# EAGLE design Gaussmeter_ver2 (EAGLE 6.2)
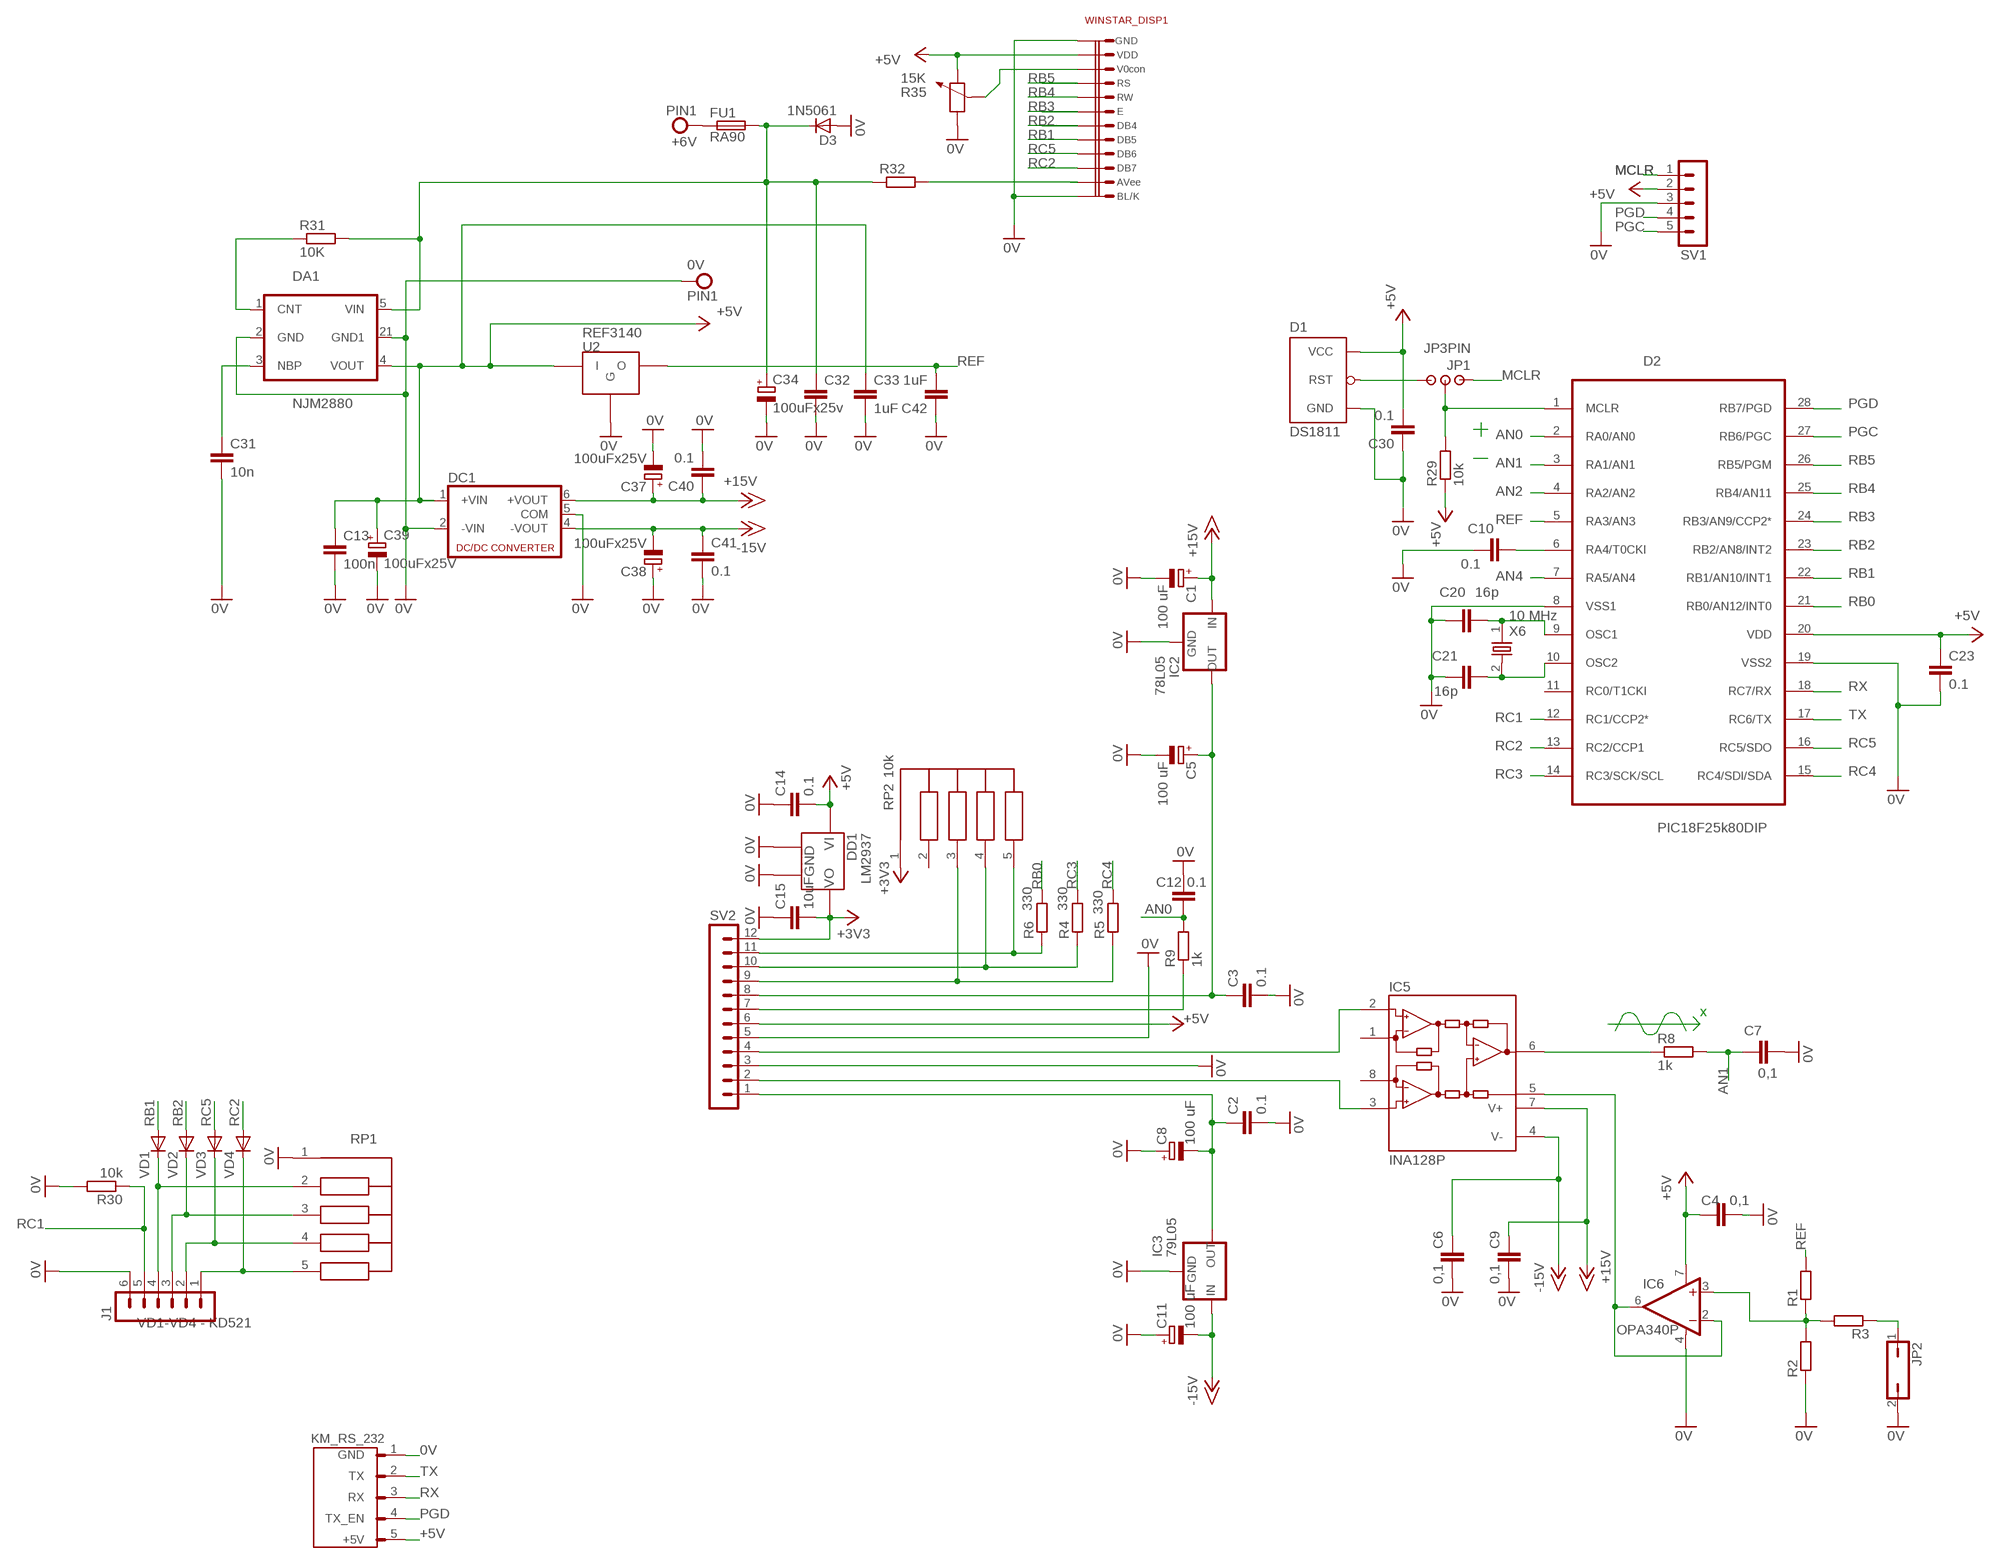
[diagram p0: schematic, sheet 1]

## Parts
0V  PIN1  [PIN1]
+6V  PIN1  [PIN1]
C1  100 uF  CPOL-EUE2.5-6  [E2,5-6]
C2  0.1  C-EUC0805  [C0805]
C3  0.1  C-EUC0805  [C0805]
C4  0,1  C-EUC0805  [C0805]
C5  100 uF  CPOL-EUE2.5-6  [E2,5-6]
C6  0,1  C-EUC0805  [C0805]
C7  0,1  C-EUC0805  [C0805]
C8  100 uF  CPOL-EUE2.5-6  [E2,5-6]
C9  0,1  C-EUC0805  [C0805]
C10  0.1  C0805  [C0805D]
C11  100 uF  CPOL-EUE2.5-6  [E2,5-6]
C12  0.1  C-EUC0805  [C0805]
C13  100n  C0805  [C0805D]
C14  0.1  C0805  [C0805D]
C15  10uF  C0805  [C0805D]
C20  16p  C0805  [C0805D]
C21  16p  C0805  [C0805D]
C23  0.1  C-EUC0805  [C0805]
C30  0.1  C0805  [C0805D]
C31  10n  C0805  [C0805D]
C32  C0805  [C0805D]
C33  1uF  C0805  [C0805D]
C34  100uFx25v  CPOL-EUE2.5-6  [E2,5-6]
C37  100uFx25V  CPOL-EUE2.5-6  [E2,5-6]
C38  100uFx25V  CPOL-EUE2.5-6  [E2,5-6]
C39  100uFx25V  CPOL-EUE2.5-6  [E2,5-6]
C40  0.1  C0805  [C0805D]
C41  0.1  C0805  [C0805D]
C42  1uF  C0805  [C0805D]
D1  DS1811  [TO92-60]
D2  PIC18F25k80DIP  PIC18F2320DIP  [DIL28-3]
D3  1N5061  [DO41-10]
DA1  NJM2880  [SOT89-5]
DC1  NMA  [NMA]
DD1  LM2937  [SOT223]
FU1  RA90  [RA90]
IC2  78L05  78LXX  [78LXX]
IC3  79L05  79LXX  [79LXX]
IC5  INA128P  [DIL08]
IC6  OPA340P  [DIL08]
J1  MA06-1  [MA06-1]
JP1  JP3PIN  [PLC-3PIN]
JP2  JP1Q  [JP1]
R1  R-EU_R0805  [R0805]
R2  R-EU_R0805  [R0805]
R3  R-EU_R0805  [R0805]
R4  330  R-EU_R0805  [R0805]
R5  330  R-EU_R0805  [R0805]
R6  330  R-EU_R0805  [R0805]
R8  1k  R-EU_R0805  [R0805]
R9  1k  R-EU_R0805  [R0805]
R29  10k  R0805  [R0805D]
R30  10k  R0805  [R0805D]
R31  10K  R0805  [R0805D]
R32  MLT025"  [0207/10]
R35  15K  RTRIM3329H  [RTRIM3329H]
RP1  NR1-4-4  [SIP5]
RP2  10k  NR1-4-4  [SIP5]
SV1  MA05-1  [MA05-1]
SV2  MA12-1  [MA12-1]
U2  REF3140  [SOT23-W]
VD1  KD521  [DO35-10]
VD2  KD521  [DO35-10]
VD3  KD521  [DO35-10]
VD4  KD521  [DO35-10]
WINSTAR_DISP1  WINSTAR16X4DSPL_12  [WINSTAR16X4_12]
X1  KM_RS_232  [KM_RS_232]
X6  10 MHz  HC49/S  [HC49/S]

## Nets
0V: 0V.P$1 C1.- C2.2 C3.2 C4.1 C5.- C6.2 C7.2 C8.+ C9.2 C10.2 C11.+ C12.2 C13.2 C14.1 C15.1 C20.2 C21.1 C23.2 C30.1 C31.2 C32.2 C33.2 C34.- C37.- C38.+ C39.- C40.2 C41.2 C42.1 D1.3(GND) D2.8(VSS1) D2.19(VSS2) D3.A DA1.2(GND) DA1.21(GND1) DC1.2(-VIN) DC1.5(COM) DD1.GND DD1.GND@1(GND) IC2.GND IC3.GND IC6.4(V-) J1.6 JP2.2 R2.1 R30.P$2 R35.1 RP1.1 SV1.3 SV2.3 SV2.5 U2.GND(G) WINSTAR_DISP1.P$1(GND) WINSTAR_DISP1.P$12(KB/L) X1.1(GND)
+3V3: C15.2 DD1.OUTPUT(VO) RP2.1 SV2.12
+5V: C4.2 C13.1 C14.2 C23.1 C30.2 C33.1 C39.+ D1.2(VCC) D2.20(VDD) DA1.4(VOUT) DC1.1(+VIN) DD1.INPUT(VI) IC6.7(V+) R29.P$1 R35.2 SV1.2 SV2.6 U2.IN(I) WINSTAR_DISP1.P$2(VDD) X1.5(+5V)
+6V: C32.1 C34.+ D3.C DA1.5(VIN) FU1.P$2 R31.P$2 R32.1
+15V: C1.+ C9.1 C37.+ C40.1 DC1.6(+VOUT) IC2.IN IC5.7(V+)
-15V: C6.1 C11.- C38.- C41.1 DC1.4(-VOUT) IC3.IN IC5.4(V-)
AN0: C12.1 D2.2(RA0/AN0) R9.2
AN1: C7.1 D2.3(RA1/AN1) R8.2
AN2: D2.4(RA2/AN2)
AN4: D2.7(RA5/AN4)
MCLR: JP1.P$1 SV1.1
N$1: J1.2 RP1.4 VD3.C
N$2: C20.1 D2.9(OSC1) X6.1
N$3: J1.3 RP1.3 VD2.C
N$4: C21.2 D2.10(OSC2) X6.2
N$5: J1.4 RP1.2 VD1.C
N$7: D2.1(MCLR) JP1.P$2 R29.P$2
N$8: J1.1 RP1.5 VD4.C
N$11: C2.1 C8.- IC3.OUT SV2.1
N$12: IC5.2(-IN) SV2.4
N$13: IC5.3(+IN) SV2.2
N$14: IC5.5(REF) IC6.2(-IN) IC6.6(OUT)
N$15: IC6.3(+IN) R1.1 R2.2 R3.2
N$16: JP2.1 R3.1
N$17: IC5.6(OUT) R8.1
N$18: R4.1 RP2.4 SV2.10
N$19: R32.2 WINSTAR_DISP1.P$11(AVEE)
N$20: R5.1 RP2.3 SV2.9
N$21: +6V.P$1 FU1.P$1
N$23: D1.1(RST) JP1.P$3
N$24: R35.3 WINSTAR_DISP1.P$3(V0CON)
N$25: C10.1 D2.6(RA4/T0CKI)
N$28: C3.1 C5.+ IC2.OUT SV2.8
N$29: R9.1 SV2.7
N$30: R6.1 RP2.5 SV2.11
N$48: DA1.1(CNT) R31.P$1
N$49: C31.1 DA1.3(NBP)
PGC: D2.27(RB6/PGC) SV1.5
PGD: D2.28(RB7/PGD) SV1.4 X1.4(TX_EN)
RB0: D2.21(RB0/AN12/INT0) R6.2
RB1: D2.22(RB1/AN10/INT1) VD1.A WINSTAR_DISP1.P$8(DB5)
RB2: D2.23(RB2/AN8/INT2) VD2.A WINSTAR_DISP1.P$7(DB4)
RB3: D2.24(RB3/AN9/CCP2*) WINSTAR_DISP1.P$6(E)
RB4: D2.25(RB4/AN11) WINSTAR_DISP1.P$5(RW)
RB5: D2.26(RB5/PGM) WINSTAR_DISP1.P$4(RS)
RC1: D2.12(RC1/CCP2*) J1.5 R30.P$1
RC2: D2.13(RC2/CCP1) VD4.A WINSTAR_DISP1.P$10(DB7)
RC3: D2.14(RC3/SCK/SCL) R4.2
RC4: D2.15(RC4/SDI/SDA) R5.2
RC5: D2.16(RC5/SDO) VD3.A WINSTAR_DISP1.P$9(DB6)
REF: C42.2 D2.5(RA3/AN3) R1.2 U2.OUT(O)
RX: D2.18(RC7/RX) X1.3(RX)
TX: D2.17(RC6/TX) X1.2(TX)
Unconnected: D2.11(RC0/T1CKI) IC5.1(RG) IC5.8(RG) RP2.2

## Notes on the sheet
- x
- VD1-VD4 - KD521

## Library data of the parts
0V +6V = den:PIN1
C1 C5 C8 C11 C34 C37-C39 = D:CPOL-EU: POLARIZED CAPACITOR, European symbol
C2-C4 C6 C7 C9 C12 C23 = rcl:C-EU: CAPACITOR, European symbol
C10 C13-C15 C20 C21 C30-C33 C40-C42 = den:C0805
D1 = den:DS1811
D2 = den:PIC18F2320
D3 = den:1N5061
DA1 = den:NJM2880
DC1 = dc-dc-converter:NMA: DC-DC CONVERTER; MF: C & D TECHNOLOGIES, INC; MPN: NMA0515SC; OC_FARNELL: 1021434; OC_NEWARK: 61K3064
DD1 = For TIMP:LM2937
FU1 = den:RA90
IC2 = v-reg:78LXX: VOLTAGE REGULATOR
IC3 = v-reg:79LXX: VOLTAGE REGULATOR
IC5 = burr-brown:INA128: Instrumentation Amplifiers Precision, Low Power; MF: TEXAS INSTRUMENTS; MPN: INA128P; OC_FARNELL: 1212410; OC_NEWARK: 74C9783
IC6 = burr-brown:OPA340: Rail-to-Rail Operational Amplifiers Single-Supply, MicroAmplifier(TM) Series; MPN: OPA340PA; OC_FARNELL: 1097413; OC_NEWARK: 97K6826
J1 = con-lstb:MA06-1: PIN HEADER; OC_FARNELL: unknown; OC_NEWARK: unknown
JP1 = den:JP3PIN
JP2 = jumper:JP1Q: JUMPER
R1-R6 R8 R9 = rcl:R-EU_: RESISTOR, European symbol
R29-R31 = den:R0805
R32 = den:MLT025
R35 = Dmitry:RTRIM3329H
RP1 RP2 = den:NR1-4-4
SV1 = con-lstb:MA05-1: PIN HEADER; OC_FARNELL: unknown; OC_NEWARK: unknown
SV2 = con-lstb:MA12-1: PIN HEADER; OC_FARNELL: unknown; OC_NEWARK: unknown
U2 = ref:REF3140
VD1-VD4 = den:KD521
WINSTAR_DISP1 = Dmitry:WINSTAR16X4DSPL_12
X1 = Dmitry:KM_RS_232
X6 = den:HC49/S

## Board
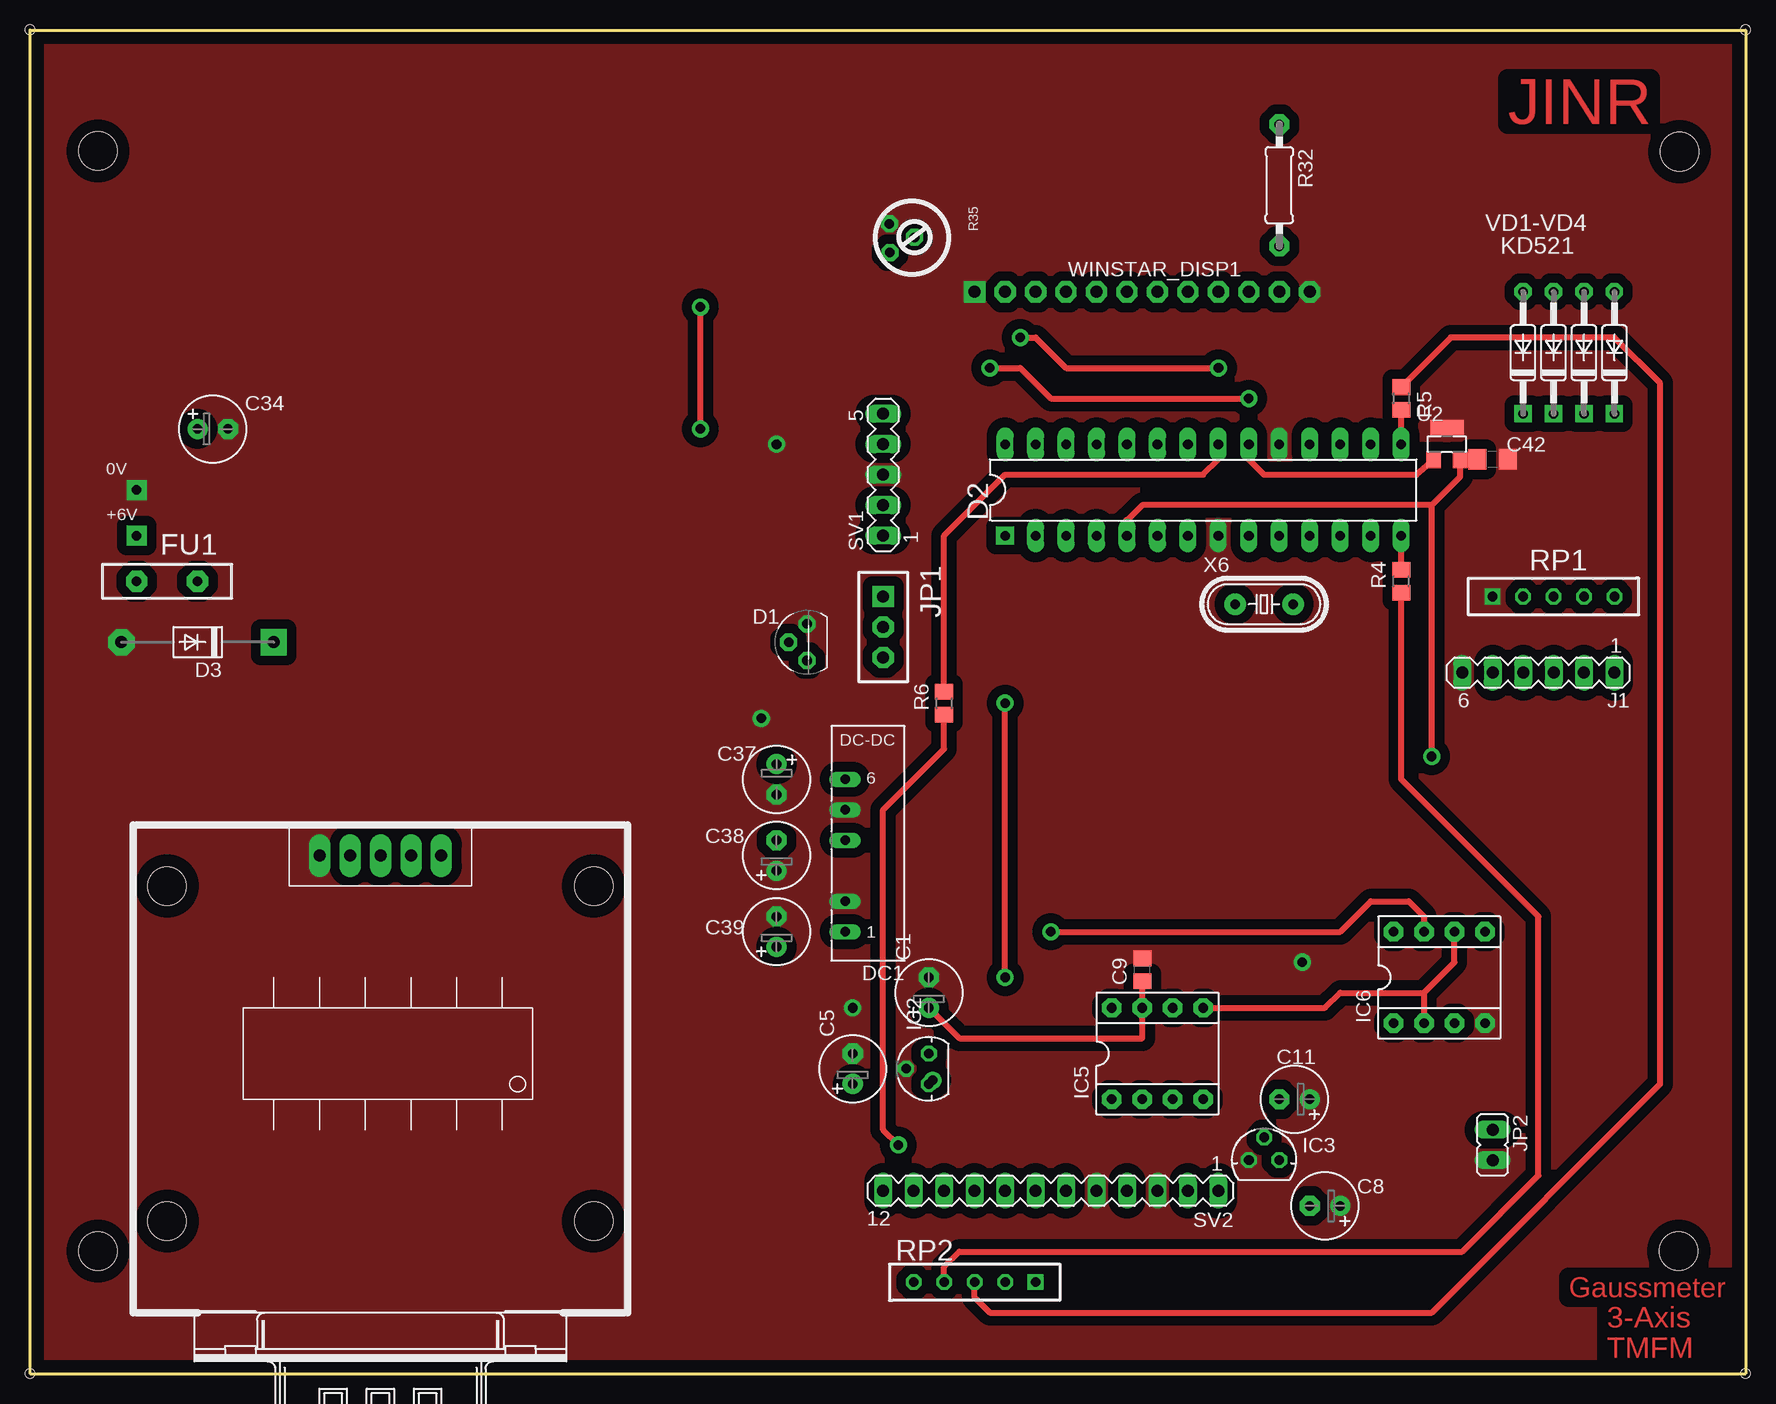
[diagram p1: board, top side]
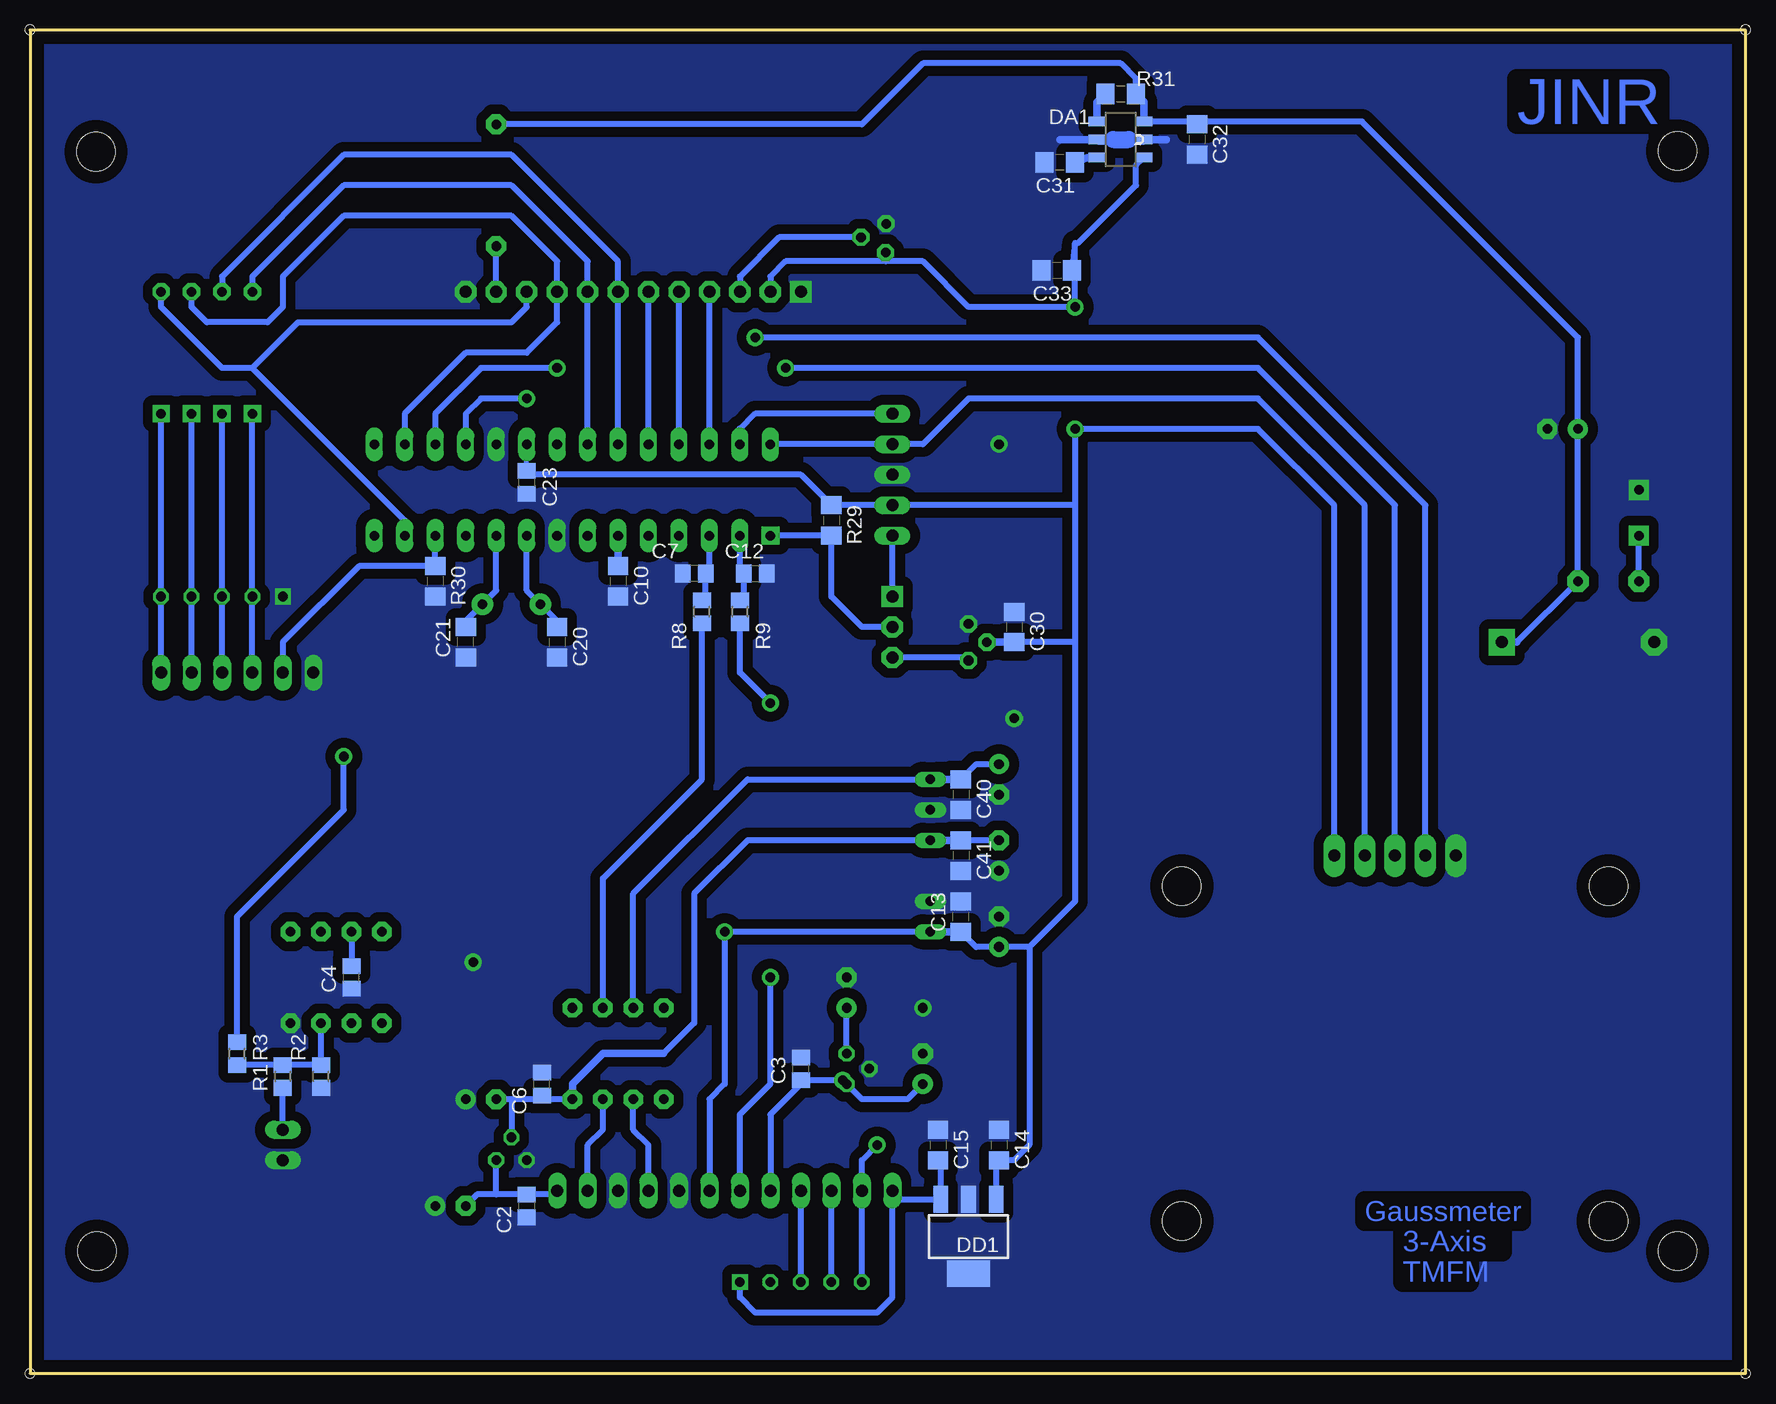
[diagram p2: board, bottom side, seen from below]

Size 143 x 112 mm. Coordinates in mm from the lower left corner, seen from the top.
Outline: 0,0 0,112 143,112 143,0 0,0
Copper layers (1*16): Top 0.035mm / dielectric 1.5mm / Bottom 0.035mm
Design rules: minimum track width 10mil, minimum drill 24mil, track to track 8mil, track to pad 8mil, pad to pad 8mil, via to via 8mil, smd to smd 8mil, copper to edge 40mil, drill to drill 8mil, minimum pad ring 10mil, minimum via ring 8mil, stop-mask expansion 4mil, vias tented up to drill 0mil, thermal gap 10mil
Holes 3.2 mm at 5.66,101.91 137.51,101.85 5.66,10.21 137.43,10.21
Holes 0.8 mm at 0,0 0,112.01 143,112.01 143,0

### Footprints (pad centres in the part's own frame; a part is rotated, then mirrored left to right if it is on the bottom)
PIN1 = drill 0.8 pad 1.676 square: P$1 0,0
E2,5-6 = drill 0.8 pad 1.676: + -1.27,0 | drill 0.8 pad 1.676 octagon: - 1.27,0
C0805 = smd 1.3 x 1.5: 1 -0.95,0; 2 0.95,0
C0805D = smd 1.5 x 1.7: 1 -1.27,0; 2 1.27,0
TO92-60 = drill 0.8 pad 1.422 octagon: 1 -1.524,0; 2 0,1.524; 3 1.524,0
DIL28-3 = drill 0.8 pad 1.5 square: 1 -16.51,-3.81 | drill 0.8 pad 1.4 long: 2 -13.97,-3.81; 3 -11.43,-3.81; 4 -8.89,-3.81; 5 -6.35,-3.81; 6 -3.81,-3.81; 7 -1.27,-3.81; 8 1.27,-3.81; 9 3.81,-3.81; 10 6.35,-3.81; 11 8.89,-3.81; 12 11.43,-3.81; 13 13.97,-3.81; 14 16.51,-3.81; 15 16.51,3.81; 16 13.97,3.81; 17 11.43,3.81; 18 8.89,3.81; 19 6.35,3.81; 20 3.81,3.81; 21 1.27,3.81; 22 -1.27,3.81; 23 -3.81,3.81; 24 -6.35,3.81; 25 -8.89,3.81; 26 -11.43,3.81; 27 -13.97,3.81; 28 -16.51,3.81
DO41-10 = drill 1 pad 2.184 octagon: A 12.7,0 | drill 1 pad 2.184 square: C 0,0
SOT89-5 = smd 0.8 x 1.4: 1 -1.499,-1.981; 2 0,-1.981; 3 1.499,-1.981; 4 1.499,1.919; 5 -1.499,1.919; 21 0,1.919
NMA@1 = drill 0.8 long: 1 0,6.35; 2 0,3.81; 4 0,-1.27; 5 0,-3.81; 6 0,-6.35
SOT223 = smd 1.219 x 2.235: GND 0,-3.099; INPUT -2.311,-3.099; OUTPUT 2.311,-3.099 | smd 3.6 x 2.2: GND@1 0,3.099
RA90 = drill 0.8 pad 1.778 octagon: P$1 -2.54,0; P$2 2.54,0
78LXX = drill 0.8 octagon: GND 0,1.905; IN 1.27,0; OUT -1.27,0
79LXX = drill 0.8 octagon: GND -1.27,0; IN 0,1.905; OUT 1.27,0
DIL08@1 = drill 0.8 pad 1.6 octagon: 1 -3.81,-3.81; 2 -1.27,-3.81; 3 1.27,-3.81; 4 3.81,-3.81; 5 3.81,3.81; 6 1.27,3.81; 7 -1.27,3.81; 8 -3.81,3.81
MA06-1@1 = drill 1 long: 1 -6.35,0; 2 -3.81,0; 3 -1.27,0; 4 1.27,0; 5 3.81,0; 6 6.35,0
PLC-3PIN = drill 1 pad 1.778 square: P$1 0,0 | drill 1 pad 1.778 octagon: P$2 2.54,0; P$3 5.08,0
JP1@1 = drill 1 long: 1 0,-1.27; 2 0,1.27
R0805 = smd 1.3 x 1.5: 1 -0.95,0; 2 0.95,0
R0805D = smd 1.5 x 1.7: P$1 -1.27,0; P$2 1.27,0
0207/10 = drill 0.8 pad 1.676 octagon: 1 -5.08,0; 2 5.08,0
RTRIM3329H = drill 0.8 pad 1.422 octagon: 1 -0.599,-2.024; 2 1.805,-1.985; 3 0.537,0.066
SIP5 = drill 0.8 square: 1 0,0 | drill 0.8 octagon: 2 0,-2.54; 3 0,-5.08; 4 0,-7.62; 5 0,-10.16
MA05-1@1 = drill 1 long: 1 -5.08,0; 2 -2.54,0; 3 0,0; 4 2.54,0; 5 5.08,0
MA12-1 = drill 1 long: 1 -13.97,0; 2 -11.43,0; 3 -8.89,0; 4 -6.35,0; 5 -3.81,0; 6 -1.27,0; 7 1.27,0; 8 3.81,0; 9 6.35,0; 10 8.89,0; 11 11.43,0; 12 13.97,0
SOT23-W = smd 2.8 x 1.4: GND 0,1.3 | smd 1.2 x 1.4: IN -1.1,-1.3; OUT 1.1,-1.3
DO35-10 = drill 0.8 pad 1.422 octagon: A 5.08,0 | drill 0.8 pad 1.422 square: C -5.08,0
WINSTAR16X4_12 = drill 1 pad 1.778 square: P$1 -13.97,1.27 | drill 1 pad 1.778 octagon: P$2 -11.43,1.27; P$3 -8.89,1.27; P$4 -6.35,1.27; P$5 -3.81,1.27; P$6 -1.27,1.27; P$7 1.27,1.27; P$8 3.81,1.27; P$9 6.35,1.27; P$10 8.89,1.27; P$11 11.43,1.27; P$12 13.97,1.27
KM_RS_232 = drill 1 pad 1.778 long: 1 20.32,5.08; 2 20.32,2.54; 3 20.32,0; 4 20.32,-2.54; 5 20.32,-5.08 | hole 3.2: -10.16,17.78; -10.16,-17.78; 17.78,17.78; 17.78,-17.78
HC49/S = drill 0.8 pad 1.778: 1 -2.413,0; 2 2.413,0

### Placement (x,y rotation side)
0V  8.89,73.66 0 top
+6V  8.89,69.85 0 top
C1  74.93,31.75 90 top
C2  101.6,13.97 270 bottom
C3  78.74,25.4 90 bottom
C4  116.2,33.02 90 bottom
C5  68.58,25.4 90 top
C6  100.33,24.13 90 bottom
C7  87.63,66.67 180 bottom
C8  107.95,13.97 180 top
C9  92.71,33.66 90 top
C10  93.98,66.04 270 bottom
C11  105.41,22.86 180 top
C12  82.55,66.67 0 bottom
C13  65.41,38.1 90 bottom
C14  62.23,19.05 270 bottom
C15  67.31,19.05 270 bottom
C20  99.06,60.96 270 bottom
C21  106.68,60.96 90 bottom
C23  101.6,74.3 270 bottom
C30  60.96,62.23 270 bottom
C31  57.15,100.97 180 bottom
C32  45.72,102.87 270 bottom
C33  57.4,91.95 180 bottom
C34  15.24,78.74 0 top
C37  62.23,49.53 270 top
C38  62.23,43.18 90 top
C39  62.23,36.83 90 top
C40  65.41,48.26 270 bottom
C41  65.41,43.18 270 bottom
C42  121.92,76.2 180 top
D1  64.77,60.96 90 top
D2  97.79,73.66 0 top
D3  20.32,60.96 180 top
DA1  52.07,102.87 270 bottom
DC1  [NMA@1]  67.94,43.18 180 top
DD1  64.77,11.43 180 bottom
FU1  11.43,66.04 0 top
IC2  74.93,25.4 90 top
IC3  102.87,17.78 0 top
IC5  INA128P  [DIL08@1]  93.98,26.67 0 top
IC6  OPA340P  [DIL08@1]  117.47,33.02 0 top
J1  [MA06-1@1]  125.73,58.42 180 top
JP1  71.12,64.77 270 top
JP2  [JP1@1]  121.92,19.05 180 top
R1  125.73,26.67 90 bottom
R2  118.75,24.77 90 bottom
R3  121.92,24.77 90 bottom
R4  114.3,66.04 90 top
R5  114.3,81.28 270 top
R6  76.2,55.88 90 top
R8  87,63.5 90 bottom
R9  83.82,63.5 90 bottom
R29  76.2,71.12 270 bottom
R30  109.22,66.04 270 bottom
R31  52.07,106.68 0 bottom
R32  104.14,99.06 270 top
R35  73.66,95.25 270 top
RP1  121.92,64.77 90 top
RP2  83.82,7.62 270 top
SV1  [MA05-1@1]  71.12,74.93 90 top
SV2  85.09,15.24 180 top
U2  118.11,77.47 0 top
VD1  124.46,85.09 90 top
VD2  127,85.09 90 top
VD3  129.54,85.09 90 top
VD4  132.08,85.09 90 top
WINSTAR_DISP1  92.71,88.9 0 top
X1  29.21,22.86 90 top
X6  102.87,64.14 0 top

### Tracks (layer width: path | path; a pad name or v marks a point on that pad's centre or on a via)
0V  (via drill 0.8 pad 1.42)
  Bottom 0.61: DA1.2 DA1.21 48.26,102.87 | 54.61,102.87 57.15,102.87
  other vias: 68.58,30.48 106.05,34.29 62.23,77.47 60.96,54.61
  pour Bottom (isolate 0.813, no thermals): 0,112 143.12,112 143,0 0,0
  pour Top (isolate 0.813, no thermals): 0,112 0,0 143,0 143,112
+3V3
  Bottom 0.508: C15.2 67.08,17.55 DD1.OUTPUT 70.41,14.53 SV2.12 71.12,6.35 72.39,5.08 82.55,5.08 83.82,6.35 RP2.1
+5V  (via drill 0.8 pad 1.42)
  Top 0.508: U2.IN 115.57,74.93 102.87,74.93 101.6,76.2 D2.20 | v55.88,78.74 v55.88,88.9 | v85.09,36.83 109.22,36.83 111.76,39.37 114.94,39.37 116.2,38.1 IC6.7
  Bottom 0.406: C23.1 D2.20
  Bottom 0.508: 101.28,74.93 78.74,74.93 R29.P$1 SV1.2 55.88,72.39 | X1.5 34.29,72.39 40.64,78.74 v55.88,78.74 55.88,72.39 | 55.88,72.39 55.88,60.96 | 55.88,60.96 C30.2 | DC1.1 v85.09,36.83 85.09,24.13 86.36,22.86 SV2.6 | WINSTAR_DISP1.P$2 81.28,91.44 80.01,92.71 71.67,92.71 | 71.67,92.71 68.58,92.71 64.77,88.9 v55.88,88.9 55.88,94.23 | 71.67,92.71 R35.2 | 55.88,60.96 55.88,39.37 59.69,35.56 | 59.69,35.56 C39.+ 64.14,35.56 C13.1 | IC6.7 C4.2 | 55.88,94.23 C33.1 | DD1.INPUT 62.46,17.55 C14.2 60.96,17.78 59.69,19.05 59.69,35.56 | 55.88,94.23 55.63,94.23 50.8,99.06 50.8,100.72 DA1.4
  Bottom 0.61: 101.28,74.93 C23.1 | C30.2 D1.2 | C13.1 DC1.1
+6V
  Bottom 0.508: 19.05,60.96 FU1.P$2 C34.+ 13.97,86.36 31.98,104.37 45.49,104.37 C32.1 45.95,104.37 DA1.5 | R32.1 73.66,104.14 68.58,109.22 52.07,109.22 50.8,107.95 R31.P$2
  Bottom 0.61: R31.P$2 50.15,106.03 DA1.5 | 19.05,60.96 D3.C
+15V
  Top 0.508: C9.1 IC5.7 92.71,27.94 77.47,27.94 C1.+
  Bottom 0.508: DC1.6 83.19,49.53 92.71,40.01 IC5.7 | IC2.IN C1.+ | C37.+ 64.14,50.8 C40.1
  Bottom 0.61: DC1.6 C40.1
-15V
  Bottom 0.508: DC1.4 83.19,44.45 87.63,40.01 87.63,29.21 90.17,26.67 | C38.- C41.1 | IC5.4 100.01,22.86 C6.1 100.65,22.86 102.87,22.86 | 102.87,22.86 C11.- | 102.87,22.86 IC3.IN
  Bottom 0.61: 90.17,26.67 95.25,26.67 97.79,24.13 IC5.4 | C41.1 DC1.4
AN0
  Bottom 0.406: C12.1 83.82,67 | 83.5,64.77 R9.2
  Bottom 0.508: 83.82,67 D2.2 | 83.5,64.77 C12.1
AN1
  Bottom 0.406: C7.1 86.36,67 | R8.2 86.68,64.77
  Bottom 0.508: 86.36,67 D2.3 | 86.68,64.77 C7.1
MCLR
  Bottom 0.508: JP1.P$1 SV1.1
N$1
  Bottom 0.508: J1.2 RP1.4 VD3.C
N$2
  Bottom 0.508: D2.9 101.6,65.28 X6.1 99.06,62.74 C20.1
N$3
  Bottom 0.508: J1.3 RP1.3 VD2.C
N$4
  Bottom 0.508: D2.10 104.14,65.28 X6.2 106.68,62.74 C21.2
N$5
  Bottom 0.508: J1.4 RP1.2 VD1.C
N$7
  Bottom 0.508: D2.1 R29.P$2 76.2,64.77 73.66,62.23 JP1.P$2
N$8
  Bottom 0.508: J1.1 RP1.5 VD4.C
N$11
  Bottom 0.508: 104.14,14.92 C2.1 99.38,14.92 SV2.1 | 104.14,14.92 105.73,14.92 C8.- | 104.14,14.92 IC3.OUT
N$12
  Bottom 0.508: IC5.2 92.71,20.32 91.44,19.05 SV2.4
N$13
  Bottom 0.508: IC5.3 95.25,20.32 96.52,19.05 SV2.2
N$14
  Top 0.508: IC5.5 107.95,30.48 109.22,31.75 116.2,31.75 | 116.2,31.75 IC6.2 | 116.2,31.75 118.75,34.29 IC6.6
N$15
  Bottom 0.508: R1.1 R3.2 R2.2 IC6.3
N$16
  Bottom 0.508: JP2.1 R3.1
N$17
  Bottom 0.508: IC5.6 95.25,41.27 87,49.53 R8.1
N$18
  Top 0.508: RP2.4 76.2,8.89 77.47,10.16 119.38,10.16 125.73,16.51 125.73,38.1 114.3,49.53 R4.1
  Bottom 0.508: RP2.4 SV2.10
N$19
  Bottom 0.508: WINSTAR_DISP1.P$11 R32.2
N$20
  Top 0.508: R5.1 118.43,86.36 132.08,86.36 135.89,82.55 135.89,24.13 116.84,5.08 80.01,5.08 78.74,6.35 RP2.3
  Bottom 0.508: RP2.3 SV2.9
N$21
  Bottom 0.508: FU1.P$1 +6V.P$1
N$23
  Bottom 0.508: 65.02,59.69 JP1.P$3
  Bottom 0.61: D1.1 65.02,59.69
N$24
  Bottom 0.508: WINSTAR_DISP1.P$3 83.82,91.44 80.55,94.71 R35.3
N$25
  Bottom 0.61: C10.1 D2.6
N$28  (via drill 0.8 pad 1.42)
  Bottom 0.508: C5.+ 69.85,22.86 73.66,22.86 IC2.OUT v75.25,24.45 C3.1 78.74,24.13 81.28,21.59 SV2.8
N$29  (via drill 0.8 pad 1.42)
  Top 0.508: v81.28,33.02 v81.28,55.88
  Bottom 0.508: R9.1 83.82,58.42 v81.28,55.88 | v81.28,33.02 81.28,24.13 83.82,21.59 SV2.7
N$30  (via drill 0.8 pad 1.42)
  Top 0.508: v72.39,19.05 71.12,20.32 71.12,46.99 76.2,52.07 R6.1
  Bottom 0.508: RP2.5 SV2.11 73.66,17.78 v72.39,19.05
N$48
  Bottom 0.61: R31.P$1 54.05,105.97 DA1.1
N$49
  Bottom 0.61: DA1.3 54.84,101.37 C31.1
PGC
  Bottom 0.508: 83.82,78.74 82.55,80.01 SV1.5
  Bottom 0.61: 83.82,78.74 D2.27
PGD
  Bottom 0.508: X1.4 31.75,72.39 40.64,81.28 64.77,81.28 68.58,77.47 SV1.4 D2.28
RB0
  Top 0.508: R6.2 76.2,69.85 81.28,74.93 97.79,74.93 99.06,76.2 D2.21
RB1
  Bottom 0.508: D2.22 WINSTAR_DISP1.P$8 96.52,92.71 102.87,99.06 116.84,99.06 124.46,91.44 VD1.A
RB2
  Bottom 0.508: D2.23 WINSTAR_DISP1.P$7 93.98,92.71 102.87,101.6 116.84,101.6 127,91.44 VD2.A
RB3
  Bottom 0.508: D2.24 WINSTAR_DISP1.P$6
RB4
  Bottom 0.508: D2.25 WINSTAR_DISP1.P$5
RB5
  Bottom 0.508: D2.26 WINSTAR_DISP1.P$4
RC1
  Bottom 0.508: D2.12 R30.P$1 115.57,67.31 121.92,60.96 J1.5
RC2
  Bottom 0.508: D2.13 111.76,71.12 124.46,83.82 | VD4.A 132.08,88.9 127,83.82 124.46,83.82 | WINSTAR_DISP1.P$10 101.6,88.9 102.87,87.63 120.65,87.63 124.46,83.82
RC3
  Top 0.508: R4.2 D2.14
RC4
  Top 0.508: D2.15 R5.2
RC5
  Bottom 0.508: D2.16 111.76,80.01 106.68,85.09 101.6,85.09 99.06,87.63 WINSTAR_DISP1.P$9 99.06,92.71 102.87,96.52 116.84,96.52 121.92,91.44 121.92,88.9 123.19,87.63 128.27,87.63 129.54,88.9 VD3.A
REF  (via drill 0.8 pad 1.42)
  Top 0.508: 116.84,72.39 92.71,72.39 91.44,71.12 | 116.84,72.39 119.21,74.76 U2.OUT | v116.84,51.44 116.84,72.39
  Top 0.61: 91.44,71.12 D2.5 | U2.OUT 119.24,76.2
  Top 1.27: 119.24,76.2 C42.2
  Bottom 0.508: v116.84,51.44 116.84,46.99 125.73,38.1 R1.2
RX  (via drill 0.8 pad 1.42)
  Top 0.508: v101.6,81.28 85.09,81.28 82.55,83.82 v80.01,83.82
  Bottom 0.508: D2.18 106.68,80.01 105.41,81.28 v101.6,81.28 | X1.3 29.21,72.39 40.64,83.82 v80.01,83.82
TX  (via drill 0.8 pad 1.42)
  Top 0.508: v99.06,83.82 86.36,83.82 83.82,86.36 v82.55,86.36
  Bottom 0.508: D2.17 109.22,80.01 105.41,83.82 v99.06,83.82 | X1.2 26.67,72.39 40.64,86.36 v82.55,86.36

### Text on the board
Top: JINR | Gaussmeter | 3-Axis | TMFM
Bottom: JINR | Gaussmeter | 3-Axis | TMFM
tNames: VD1-VD4 | KD521